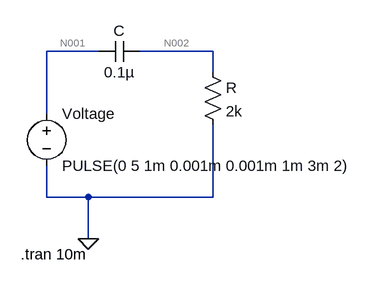
[diagram p0: schematic RC.asc]
RC.asc, the LTspice schematic file:
Version 4
SHEET 1 880 680
WIRE -80 32 -160 32
WIRE 96 32 -16 32
WIRE 96 64 96 32
WIRE -160 128 -160 32
WIRE -160 256 -160 208
WIRE -96 256 -160 256
WIRE 96 256 96 144
WIRE 96 256 -96 256
WIRE -96 320 -96 256
FLAG -96 320 0
SYMBOL voltage -160 112 R0
WINDOW 123 0 0 Left 0
WINDOW 39 0 0 Left 0
SYMATTR InstName Voltage
SYMATTR Value PULSE(0 5 1m 0.001m 0.001m 1m 3m 2)
SYMBOL res 80 48 R0
SYMATTR InstName R
SYMATTR Value 2k
SYMBOL cap -16 48 M270
WINDOW 0 32 32 VTop 2
WINDOW 3 0 32 VBottom 2
SYMATTR InstName C
SYMATTR Value 0.1µ
TEXT -200 344 Left 2 !.tran 10m

The netlist it stands for:
* RC.asc
Voltage N001 0 PULSE(0 5 1m 0.001m 0.001m 1m 3m 2)
R N002 0 2k
C N002 N001 0.1µ
.tran 10m
.backanno
.end

* Results of the author's LTspice run, read from the files saved beside the schematic
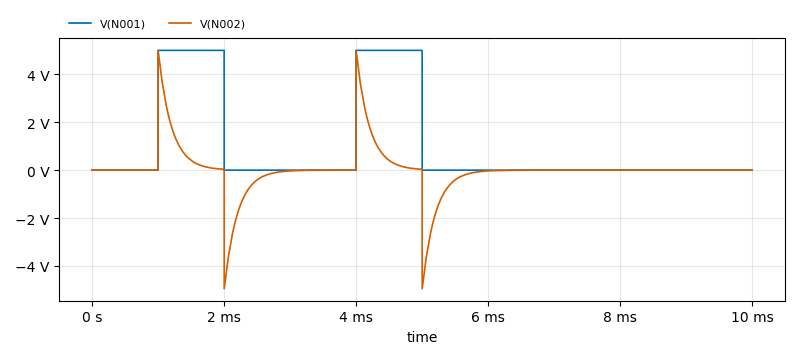
[diagram p1: Transient Analysis of RC.asc, plotted from the saved traces]
* Transient Analysis, 1 run:
*   V(N001): min 0 V, max 5 V, average 1.001 V, rms 2.237 V, last 0 V
*   V(N002): min -4.954 V, max 4.988 V, average -20.71 µV, rms 1.01 V, last 0 V